# Altium project Hydra A1 UCLO 35131D.PrjPCB (part 14 of 14)
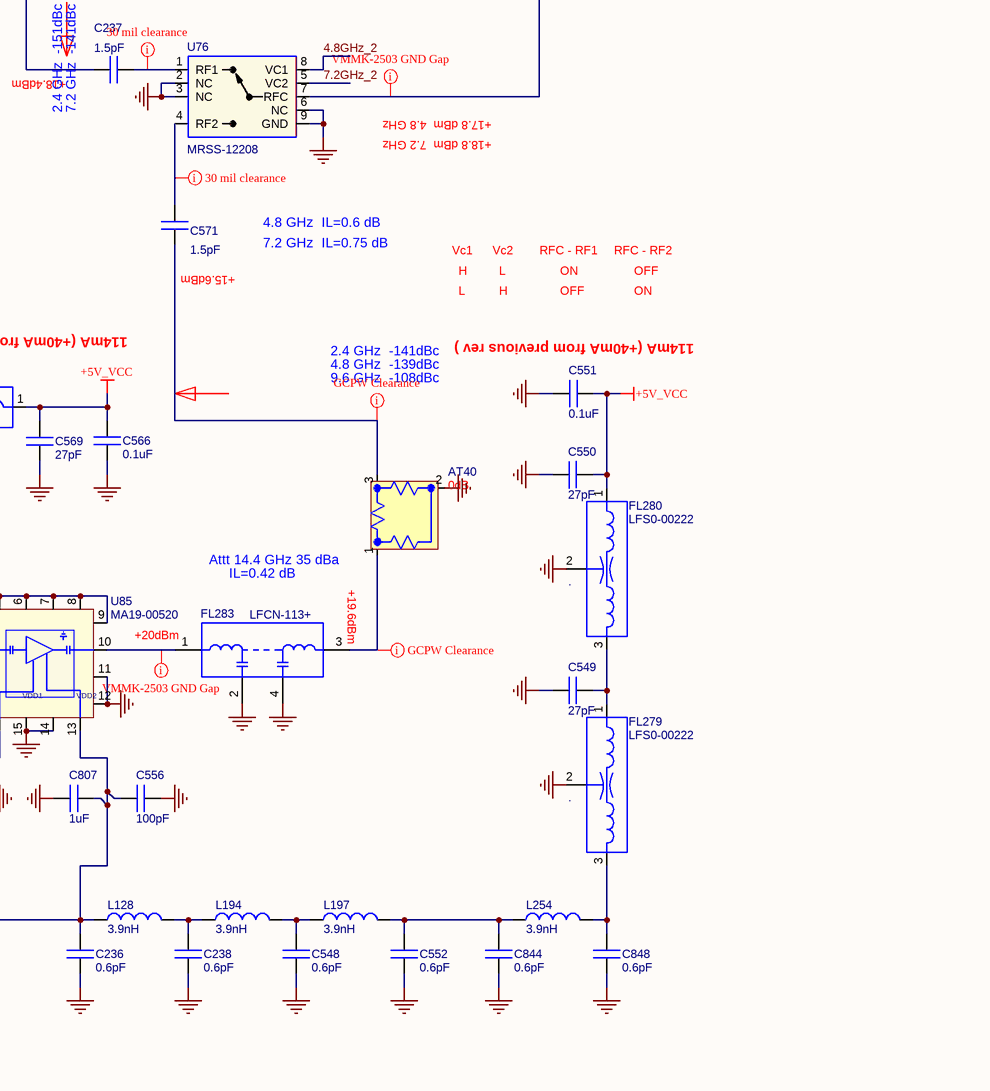
[diagram p77: Modulation.SchDoc, bottom right]

## Sheet Modulation.SchDoc: Modulation (continued)

### Notes on the sheet
- IF STRIP PLUS FREQ MULTIPLIERS
- (near FL67) IL=2 dB
- Attt 4.8 GHz 41 dBa
- Attt 7.2 GHz 28 dBa
- IL=0.3 dB
- (near U92) CL=10 dB
- -13.5 dBm
- CF = 6 GHz
- G = 13.8 dB
- P1 = +17 dBm
- (near L188) 65mA
- CL=9 dB
- CF = 3.6 GHz
- 65mA
- (near FL69) IL=2.5 dB
- (near FL71) IL=2.5 dB
- -18.3dBm (U/C)
- (near U123) P1 = +17 dBm
- (near U123) G = 14 dB
- -4.3 dBm (U/C)
- (near U96) RF2
- (near U96) Vdd
- 1200 MHz Mod from A3
- ??
- (near J16) -4.09 dBm
- -17 dBm (U/C)
- -3.2 dBm (U/C)
- (near FL71) -5.7dBm
- (near U104) -14.7 dBm
- -7.9 dBm
- (near U96) Vctl
- +18.8 dBm  7.2 GHz
- +17.8 dBm  4.8 GHz
- (near FL68) IL=2 dB
- RF1
- (near U96) EN
- -12 dBm
- IL=3.6 dB
- INT 3.6GHz
- P1 = +34 dBm
- (near U96) IL = 1 dB
- (near FL228) EXT 3.6GHz
- +17.7dBm
- Vctl
- L
- H
- EN
- RFC - RF1
- OFF
- ON
- (near FL228) RFC - RF2
- 2.4 GHz  -43dBc
- Attt 2.4 GHz 54 dBa
- Attt 7.2 GHz 27 dBa
- IL=3 dB
- (near FL285) -1.3dBm
- 2.4 GHz  -97dBc
- 7.2 GHz  -71dBc
- G = 14 dB
- P1 = +18 dBm
- +12.7dBm
- IL=6 dB
- 2.4 GHz  -151dBc
- (near FL289) +2 dBm
- 7.2 GHz  -98dBc
- Attt 7.2 GHz 43 dBa
- Attt 9.6 GHz 29 dBa
- IL=0.6 dB
- 1.2 GHz  -143dBc
- 3.6 GHz  -102.5dBc
- 78mA
- (near AT37) 7.2 GHz  -44dBc
- (near U99) +19 dBm
- +17.9dBm
- Attt 1.2 GHz 35 dBa
- Attt 3.6 GHz 18.5 dBa
- IL=1.7 dB
- (near U100) +1.7dBm
- +7.4 dBm
- +5.7 dBm
- (near R255) IL=1.3 dB
- (near AT19) +4.4 dBm
- (near C343) +18 .5dBm
- (near U100) Pin = 10-20 dBm
- 7.2 GHz  -141dBc
- 3.6 GHz  -84dBc
- 1.2 GHz  -108dBc
- +3.4dBm
- (near U100) CL = 15 dB
- (near C237) +18.4dBm
- (near R258) CL=14 dB
- P1 = 17.7 dBm
- G = 21.8 dB
- (near AT27) +16.7dBm
- Attt 3.6 GHz 20 dBa
- IL=0.7 dB
- 75 mA
- -8.3 dBm
- 4.8 GHz  IL=0.6 dB
- 1.2 GHz  -178dBc
- 3.6 GHz  -121dBc
- (near AT27) 1.2 GHz  -178dBc
- (near AT27) 3.6 GHz  -141dBc
- (near FL267) +17.1dBm
- (near U101) P1 = +30 dBm typ
- DC - 8 GHz
- (near FL267) IL=0.8 dB
- +17.8dBm
- (near C571) +15.6dBm
- 7.2 GHz  IL=0.75 dB
- Vc1
- Vc2
- RFC - RF2
- (near U57) +13.5dBm
- +2.8 dBm
- +18 .5dBm
- 114mA (+40mA from previous rev )
- 2.4 GHz  -141dBc
- 4.8 GHz  -139dBc
- (near C551) 114mA (+40mA from previous rev )
- 9.6 GHz  -108dBc
- +11.8dBm
- DCR=2.5 ohm
- 2.4 GHz  -10.32dBc
- 4.8 GHz  -46dBc
- 2.4 GHz  -69dBc
- G = 13.5 dB
- Attt 2.4 GHz 72 dBa
- Attt 4.8 GHz 45 dBa
- (near U85) P1 = +17 dBm
- (near AT40) Attt 14.4 GHz 35 dBa
- 9.6 GHz  -65dBc
- +2.2dBm
- (near FL277) -2dBm
- 4.8 GHz  -94dBc
- Attt 9.6 GHz 43 dBa
- CF = 7.2 GHz
- (near FL72) IL=2 dB
- (near U85) +0.5dBm
- +20dBm
- IL=0.42 dB
- (near FL283) +19.6dBm
- (near FL268) +17.1dBm
- (near U105) +16dBm
- (near U122) +11.5dBm
- (near AT33) +9.5dBm
- 3.6 GHz  -141dBc
- CL = 13.8 dB
- Pin = 13-17 dBm
- IL=1.1 dB
- (near AT29) IL=4.2 dB
- (near AT33) 4.8 GHz  -139dBc
- Attt 2.4 GHz 59 dBa
- Attt 4.8 GHz 48 dBa
- HFCN-6010+_Cascaded.wsx
- Title
- Sheet Title
- PRINTED DOCUMENT IS CONSIDERED UNCONTROLLED. VERIFY REVISION IN PLM SYSTEM.
- THIS DOCUMENT CONTAINS PROPRIETARY INFORMATION. DESIGN RIGHTS BELONG TO GIGA-TRONICS AND MAY NOT BE REPRODUCED WITHOUT WRITTEN AUTHORIZATION FOR ANY REASON EXCEPT CALIBRATION, OPERATION AND MAINTENANCE.
- Size
- CAGE CODE
- Filename
- D
- Document Number
- 58900
- Date
- Sheet
- Rev
- of
- (in symbol LFS0-00222) ,
- (in symbol LFS0-00250) ,
- (in symbol MA19-00520) G
- (in symbol MX02-00103) x 2
- (in symbol MX03-00610) x 3

### Library data of the parts
A1_J18 = 35860: SHIELD,HYDRA,A1-J18; MFGR: Any; Approved: MH; level: 1; ModifyDate: 08/28/15; M_PN: Any; G_PN: 35860; Value: 35860; item_number: 35860
AT17 AT30 AT32-AT36 AT38 AT40 AT41 = MPFC-A1000: NoLoad: .; Approved: CL; M_PN: IMS1141-00DB; MFGR: IMS RESISTORS; level: 1; line_number: 50; ModifyDate: 4/16/13; G_PN: MPFC-A1000; item_number: MPFC-A1000
AT18 = MPFC-A1003: NoLoad: .; Approved: CL; M_PN: IMS1141-03DB; MFGR: IMS RESISTORS; level: 1; line_number: 25; G_PN: MPFC-A1003; item_number: MPFC-A1003
AT19 AT27 AT28 AT37 = MPFC-A1001: NoLoad: .; Approved: CL; M_PN: IMS1141-01DB; MFGR: IMS RESISTORS; level: 1; line_number: 15; G_PN: MPFC-A1001; item_number: MPFC-A1001
  AT27 AT28 AT37: ModifyDate: 3/8/13
AT22 AT29 AT39 = MPFC-A1002: NoLoad: .; Approved: CL; M_PN: IMS1141-02DB; MFGR: IMS RESISTORS; level: 1; line_number: 10; ModifyDate: 3/8/13; G_PN: MPFC-A1002; item_number: MPFC-A1002
AT26 = MPFC-A1009: NoLoad: .; Approved: CL; M_PN: IMS1141-09DB; MFGR: IMS RESISTORS; level: 1; line_number: 40; G_PN: MPFC-A1009; item_number: MPFC-A1009
AT73 AT74 = MPFC-B1002: NoLoad: .; Approved: CL; M_PN: IMS-2533-02DB; MFGR: IMS RESISTORS; level: 1; line_number: 1350; ModifyDate: 10/18/16; G_PN: MPFC-B1002; item_number: MPFC-B1002
C63 C237 C239 C324 C472 C475 C476 C546 C547 C562 C565 C567 C570 C571 C799 = CK41-00015: Approved: CL; NoLoad: .; M_PN: 600L1R5AT200; MFGR: ATC; level: 1; line_number: 170; G_PN: CK41-00015; ModifyDate: 02/09/13; item_number: CK41-00015
C166 C235 C349 C350 C423 C432 C487 C489 C490 C492 C494 C495 C497 C519 C535 C536 C538 C971 = CK41-00056: MFGR: ATC; M_PN: 600L5R6BT200; Approved: CL; NoLoad: .; level: 1; line_number: 120; ModifyDate: 3/11/13; G_PN: CK41-00056; item_number: CK41-00056
C236 C238 C548 C552 C844 C848 = CK41-00006: Approved: CL; NoLoad: .; M_PN: 600L0R6AT200; MFGR: ATC; level: 1; line_number: 225; G_PN: CK41-00006; ModifyDate: 02/22/12; item_number: CK41-00006
C252 C480 C481 C557 C561 = CK41-00005: Approved: CL; NoLoad: .; M_PN: 600L0R5AT200; MFGR: ATC; level: 1; line_number: 130; G_PN: CK41-00005; ModifyDate: 02/22/12; item_number: CK41-00005
C257 C261 C422 C445 C488 C493 C511 C518 C549 C550 C554 C555 C559 C560 C568 C569 = CK40-00270: MFGR: ANY; Approved: CL; NoLoad: .; level: 1; line_number: 215; ModifyDate: 02/22/12; M_PN: ANY; G_PN: CK40-00270; item_number: CK40-00270
C342-C348 C496 = CK40-00120: MFGR: ANY; Approved: CL; NoLoad: .; level: 1; line_number: 165; ModifyDate: 10/06/12; M_PN: ANY; G_PN: CK40-00120; item_number: CK40-00120
C424 C486 C491 = CK40-04100: Approved: CL; NoLoad: .; MFGR: VENKEL; M_PN: C0402X7R160-104KNP; level: 1; line_number: 95; ModifyDate: 3/29/13; G_PN: CK40-04100; item_number: CK40-04100
C434 = CK41-00015: Approved: CL; M_PN: 600L1R5AT200; MFGR: ATC; Value: 1.5pF; level: 1; line_number: 170; G_PN: CK41-00015; ModifyDate: 02/09/13; item_number: CK41-00015
C446 C448 C479 C517 C540 C545 C551 C553 C558 C566 = CK40-04100: Approved: CL; NoLoad: .; M_PN: C0402X7R160-104KNP; MFGR: VENKEL; level: 1; line_number: 95; ModifyDate: 3/29/13; G_PN: CK40-04100; item_number: CK40-04100
C447 = CK40-01470: MFGR: Any; Approved: CL; NoLoad: .; level: 1; line_number: 75; ModifyDate: 02/22/12; M_PN: Any; G_PN: CK40-01470; item_number: CK40-01470
C473 C474 C477 C478 = CK41-00056: Approved: CL; NoLoad: .; M_PN: 600L5R6BT200; MFGR: ATC; level: 1; line_number: 120; G_PN: CK41-00056; ModifyDate: 3/11/13; item_number: CK41-00056
C510 C512 = CK41-00008: NoLoad: .; MFGR: ATC; M_PN: 600L0R8AT200; Approved: CL; level: 1; line_number: 230; G_PN: CK41-00008; ModifyDate: 02/22/12; item_number: CK41-00008
C514 = CK41-00010: NoLoad: .; MFGR: ATC; M_PN: 600L1R0AT200; Approved: CL; level: 1; line_number: 220; G_PN: CK41-00010; ModifyDate: 3/7/13; item_number: CK41-00010
C516 C520 C521 C541-C544 = CK41-00024: NoLoad: .; MFGR: ATC; M_PN: 600L2R4AT200; Approved: CL; level: 1; line_number: 60; G_PN: CK41-00024; ModifyDate: 02/09/13; item_number: CK41-00024
C556 C564 C805 C819 = CK40-01100: Approved: CL; NoLoad: .; M_PN: Any; level: 1; line_number: 70; G_PN: CK40-01100; ModifyDate: 3/21/12; MFGR: Any; item_number: CK40-01100
C563 C801 C807 C824 = CK40-15100: Approved: CL; NoLoad: .; M_PN: C0402X5R160-105KNP; MFGR: VENKEL; level: 1; line_number: 227; ModifyDate: 4/23/13; G_PN: CK40-15100; item_number: CK40-15100
FL32 FL282 = MFH0-02100: MFGR: MINI-CIRCUITS; Approved: CL; Value: HFCN-2100D+; NoLoad: .; level: 1; line_number: 425; G_PN: MFH0-02100; ModifyDate: 3/14/13; item_number: MFH0-02100
FL67 FL68 = 3.6 GHz BPF: Approved: CL; level: 1; ModifyDate: 5/30/13
FL69 FL71 = 6 GHz BPF: Approved: CL; level: 1; MFGR: N/A; ModifyDate: 6/2/13; M_PN: N/A; G_PN: N/A
FL72 = 7.2_GHz_BPF: Approved: CL; level: 1; MFGR: N/A; ModifyDate: 6/2/13
FL212 FL213 FL216 FL217 FL223 FL225-FL227 FL232 FL258 FL259 FL265 FL274 FL275 FL279-FL281 FL287 FL288 FL292 FL293 = LFS0-00222: Approved: CL; NoLoad: .; M_PN: NFE31PT222Z1E9BL; MFGR: MURATA; level: 1; line_number: 335; G_PN: LFS0-00222; ModifyDate: 02/22/12; Value: 2200pF; item_number: LFS0-00222
FL220 FL224 = MFB0-02360: MFGR: MINI-CIRCUITS; Approved: NM; Value: BFCN-2360+; NoLoad: .; level: 1; line_number: 365; ModifyDate: 12/04/12; M_PN: BFCN-2360+; G_PN: MFB0-02360; item_number: MFB0-02360
FL228 FL260 FL266 FL276 = LFS0-00250: Approved: NM; NoLoad: .; M_PN: NFL18ST207X1C3; MFGR: MURATA; level: 1; line_number: 415; ModifyDate: 02/22/12; Value: 25pF; G_PN: LFS0-00250; item_number: LFS0-00250
FL231 = MFL0-03000: MFGR: MINI-CIRCUITS; Approved: CL; Value: LFCN-3000D+; NoLoad: .; level: 1; line_number: 370; G_PN: MFL0-03000; ModifyDate: 3/8/13; item_number: MFL0-03000
FL267 FL268 = MFL0-02500: MFGR: MINI-CIRCUITS; Approved: CL; Value: LFCN-2500+; NoLoad: .; level: 1; line_number: 460; G_PN: MFL0-02500; ModifyDate: 3/5/13; item_number: MFL0-02500
FL277 FL278 = MFH0-06010: MFGR: MINI-CIRCUITS; Approved: CL; Value: HFCN-6010+; NoLoad: .; level: 1; line_number: 390; G_PN: MFH0-06010; ModifyDate: 3/12/13; item_number: MFH0-06010
FL283 = MFL0-11000: MFGR: MINI-CIRCUITS; Approved: CL; Value: LFCN-113+; NoLoad: .; level: 1; line_number: 395; G_PN: MFL0-11000; ModifyDate: 3/14/13; item_number: MFL0-11000
FL285 FL289 = MFH0-04400: MFGR: MINI-CIRCUITS; Approved: CL; Value: HFCN-4400D+; NoLoad: .; level: 1; line_number: 400; G_PN: MFH0-04400; ModifyDate: 3/14/13; item_number: MFH0-04400
FL286 FL290 FL291 = MFL0-05850: NoLoad: .; Value: LFCN-5850D+; MFGR: Mini-Circuits; Approved: NM; level: 1; line_number: 405; ModifyDate: 3/15/13; M_PN: LFCN-5850D+; G_PN: MFL0-05850; item_number: MFL0-05850
FL296 FL297 = MFL1-03900: MFGR: MINI-CIRCUITS; Approved: CL; Value: LFCN-3800D+; NoLoad: .; level: 1; line_number: 470; G_PN: MFL1-03900; ModifyDate: 3/21/13; item_number: MFL1-03900
FT14 FT30 = FromToNode: level: 1; Approved: *; G_PN: *; MFGR: *; Value: *
J16 J22 = JRSM-70101: Value: B012-P93-02; MFGR: GILBERT; Approved: CL; NoLoad: .; level: 1; line_number: 480; M_PN: B012-P93-02; ModifyDate: 10/15/14; G_PN: JRSM-70101; item_number: JRSM-70101
J18 = JRSM-60101: SMPM SM MALE,STRAIGHT SMT, R/A COPLANAR, 4 PIN THRU-HOLE; Value: B012-P95-02; MFGR: GILBERT; Approved: CL; NoLoad: .; level: 1; line_number: 483; M_PN: B012-P95-02; ModifyDate: 1/6/14; G_PN: JRSM-60101; item_number: JRSM-60101
J19 = JRSM-40101: Value: 3287-6101; MFGR: SV MICROWAVE; Approved: CL; level: 1; M_PN: 3287-6101; ModifyDate: 4/10/13; G_PN: JRSM-40101; item_number: JRSM-40101
J21 = JRSM-80100: Value: B012-P93-01; MFGR: Corning Gilbert; Approved: CL; NoLoad: .; level: 1; line_number: 486; M_PN: B012-P93-01; ModifyDate: 10/15/14; G_PN: JRSM-80100; item_number: JRSM-80100
L51 = LSA5-03270: M_PN: 0603HP-27NXGLU; MFGR: COILCRAFT; NoLoad: .; Approved: CL; level: 1; line_number: 565; G_PN: LSA5-03270; ModifyDate: 3/11/13; item_number: LSA5-03270
L122 L189 L191 L192 = LSA6-03150: M_PN: 0402HP-15NXGLU; MFGR: COILCRAFT; NoLoad: .; Approved: CL; level: 1; line_number: 515; G_PN: LSA6-03150; ModifyDate: 3/8/13; item_number: LSA6-03150
L123 L125 = LSA5-03270: MFGR: COILCRAFT; NoLoad: .; Approved: CL; M_PN: 0603HP-27NXGLU; level: 1; line_number: 565; ModifyDate: 3/11/13; G_PN: LSA5-03270; item_number: LSA5-03270
L127 L168-L170 L185 L193 L195 L196 L201-L203 = LSA6-02750: M_PN: 0402HP-7N5XGLU; MFGR: COILCRAFT; NoLoad: .; Approved: CL; level: 1; line_number: 530; G_PN: LSA6-02750; ModifyDate: 3/18/13; item_number: LSA6-02750
L128 L184 L194 L197-L200 L254 = LSA6-02390: M_PN: 0402HP-3N9XGLU; MFGR: COILCRAFT; NoLoad: .; Approved: CL; level: 1; line_number: 620; G_PN: LSA6-02390; ModifyDate: 3/13/13; item_number: LSA6-02390
L186 L187 = LSA6-02560: M_PN: 0402HP-5N6XGLU; MFGR: COILCRAFT; NoLoad: .; Approved: CL; level: 1; line_number: 595; G_PN: LSA6-02560; ModifyDate: 3/4/13; item_number: LSA6-02560
L188 = LSA6-02560: INDUCTOR;5.6NH;2%;6.6GHZ SRF;105Q @1.7GHZ;.048 DCR;1.6A;0402; M_PN: 0402HP-5N6XGLU; MFGR: COILCRAFT; NoLoad: .; Approved: CL; level: 1; line_number: 595; G_PN: LSA6-02560; ModifyDate: 3/4/13; item_number: LSA6-02560
L188DC L190DC = TLW0-01220: Inductor, broadband, 0.22uH, 0.138IN long, DCR=0.10 Ohms; M_PN: BCL-221JL; MFGR: Coilcraft; Approved: XiaoXiao Zhou; level: 1; line_number: 532; Value: 0.22uH; G_PN: TLW0-01220; item_number: TLW0-01220
L190 = LSA6-03150: INDUCTOR;15NH;2%;3.9GHZ SRF;85Q @1.7GHZ;.078 DCR;1.1A;0402; M_PN: 0402HP-15NXGLU; MFGR: COILCRAFT; Approved: CL; level: 1; line_number: 515; G_PN: LSA6-03150; ModifyDate: 3/8/13; item_number: LSA6-03150
MTG32 MTG33 MTG36 MTG37 MTG45 MTG75 MTG86 MTG87 MTG89-MTG93 MTG147-MTG172 MTG178-MTG191 MTG200 = MHP200X92: level: 1; ModifyDate: 02/14/2008 14:07:19; Value: *
R17 R20 R22 R23 = RK35-00499: Approved: CL; NoLoad: .; MFGR: ANY; level: 1; line_number: 650; ModifyDate: 02/22/12; G_PN: RK35-00499; M_PN: ANY; item_number: RK35-00499
R252 R259 R389 = RK65-00392: NoLoad: .; MFGR: VISHAY/DALE; Approved: CL; M_PN: CRCW201039R2FKEF; level: 1; line_number: 892; ModifyDate: 10/14/14; G_PN: RK65-00392; item_number: RK65-00392
R255 = RK35-01210: Approved: CL; NoLoad: .; M_PN: ANY; level: 1; line_number: 770; ModifyDate: 02/22/12; MFGR: ANY; G_PN: RK35-01210; item_number: RK35-01210
R258 = RK35-01210: NoLoad: .; MFGR: ANY; Approved: CL; level: 1; line_number: 770; ModifyDate: 02/22/12; G_PN: RK35-01210; M_PN: ANY; item_number: RK35-01210
R391 R392 R398 R458-R460 = RK35-11000: NoLoad: .; Approved: CL; MFGR: ANY; level: 1; line_number: 1025; G_PN: RK35-11000; ModifyDate: 02/22/12; M_PN: ANY; item_number: RK35-11000
R396 R397 R496 R497 = RK35-03010: NoLoad: .; Approved: CL; MFGR: ANY; level: 1; line_number: 835; G_PN: RK35-03010; ModifyDate: 4/12/12; M_PN: ANY; item_number: RK35-03010
U57 U95 U103 = MA20-00006: M_PN: SKY65017-70LF; Approved: CL; MFGR: SKYWORKS; NoLoad: .; Value: SKY65017-70LF; level: 1; line_number: 1160; G_PN: MA20-00006; ModifyDate: 6/26/14; item_number: MA20-00006
U76 = MRSS-12208: M_PN: MASW-007107; NoLoad: .; Approved: NM; MFGR: MA-COM; level: 1; line_number: 1305; ModifyDate: 12/06/12; G_PN: MRSS-12208; item_number: MRSS-12208
U85 = MA19-00520: Value: HMC451LC3; NoLoad: .; Approved: CL; MFGR: HITTITE; level: 1; line_number: 1323; ModifyDate: 1/25/13; G_PN: MA19-00520; M_PN: HMC451LC3; item_number: MA19-00520
U90 U90DC U123 U123DC = MA14-00112: AMP;1-12GHz;13.5dB;+17dBm;5V;68mA;WLP-0402; Approved: NM; MFGR: AVAGO; level: 1; line_number: 1340; ModifyDate: 11/28/12; G_PN: MA14-00112; item_number: MA14-00112
  U90DC U123 U123DC: M_PN: VMMK-2503
U92 = MMDC-00310: MIXER;3-10GHZ;+17DBM;0-4GHZ IF;.118INX.118INX.036IN SMT; MFGR: HITTITE; NoLoad: .; Value: HMC787LC3B; level: 1; line_number: 1345; ModifyDate: 1/15/14; M_PN: HMC787LC3B; G_PN: MMDC-00310; item_number: MMDC-00310
U96 = MRSS-12206: MFGR: HITTITE; Approved: CL; Value: HMC849ALP4CE; NoLoad: .; level: 1; line_number: 1347; ModifyDate: 8/5/14; G_PN: MRSS-12206; item_number: MRSS-12206
U98 U122 = MA14-00112: NoLoad: .; Approved: NM; MFGR: AVAGO; level: 1; line_number: 1340; ModifyDate: 11/28/12; G_PN: MA14-00112; item_number: MA14-00112
U99 = MA19-00520: NoLoad: .; Approved: CL; MFGR: HITTITE; Value: HMC451LC3; level: 1; line_number: 1323; ModifyDate: 1/25/13; M_PN: HMC451LC3; G_PN: MA19-00520; item_number: MA19-00520
U100 = MX02-00103: M_PN: HMC188MS8E; NoLoad: .; Approved: CL; MFGR: HITTITE; Value: HMC188MS8E; level: 1; line_number: 1100; ModifyDate: 3/11/13; G_PN: MX02-00103; item_number: MX02-00103
U101 = MRSS-12004: Value: HMC284MS8GE; MFGR: HITTITE; NoLoad: .; Approved: CL; level: 1; line_number: 1105; ModifyDate: 6/1/13; M_PN: HMC284MS8GE; G_PN: MRSS-12004; item_number: MRSS-12004
U104 = MMDD-00612: MIXER;6-12GHZ;+17DBM;0-4GHZ IF;.118INX.118INX.036IN SMT; MFGR: HITTITE; NoLoad: .; Value: HMC663LC3; level: 1; line_number: 1107; ModifyDate: 9/17/13; M_PN: HMC663LC3; G_PN: MMDD-00612; item_number: MMDD-00612
U105 = MX03-00610: NoLoad: .; Approved: CL; MFGR: MINI-CIRCUITS; Value: RMK-3-14+; level: 1; line_number: 1110; ModifyDate: 3/12/13; G_PN: MX03-00610; item_number: MX03-00610
U110 = UTD3-00049: M_PN: NL27WZ04DFT2G; Value: NL27WZ04DFT2G; NoLoad: .; Approved: CL; MFGR: ON SEMI; level: 1; line_number: 1250; ModifyDate: 02/22/12; G_PN: UTD3-00049; item_number: UTD3-00049

## Nets that join several sheets
+2.5V_Dig: Power Distribution Block Diagram (J30.1), A3 to A1 board Connector b (16 pins)
+3.3V_dig: Power Distribution Block Diagram (J29.5), A3 to A1 board Connector b (15 pins)
+3.3V_mux: Analog Mux (FL5.3), Power Distribution Block Diagram (J29.6)
+3.3V_ST: Power Distribution Block Diagram (C509.2 J29.8), STALO_2 (C891.1 C892.2 FL22.3)
+3.3V_vco: Fast PLL (15 pins), Power Distribution Block Diagram (C508.2 J29.9)
+3V_A1-A1: A1-A1 Active Bias (FL109.1 FL116.1 FT25.1 TP5.1), Power Distribution Block Diagram (J30.2)
+5V_A1-A1: A1-A1 Active Bias (10 pins), Power Distribution Block Diagram (J30.6)
+5V_A1-A2: Power Distribution Block Diagram (J30.9), A1-A2 Power (FL165.1 TP11.1)
+5V_A1-A3: Analog Mux (5 pins), Power Distribution Block Diagram (J30.8)
+5V_alc: A1-A2 Switches new (8 pins), A1-A1 Gain control driver (9 pins), Power Distribution Block Diagram (J31.4)
+5V_dig: Power Distribution Block Diagram (J31.3), A3 to A1 board Connector b (23 pins)
+5V_mux: Analog Mux (10 pins), Power Distribution Block Diagram (J31.5)
+5V_ST: Power Distribution Block Diagram (J33.1), STALO_2 (7 pins), STALO_1 (7 pins), STALO_3 (6 pins)
+5V_SW: A1-A2 Switches new (39 pins), A1-A1 Switches Control Logic (19 pins), A1-A1 Switches new (113 pins), Power Distribution Block Diagram (J30.4), A3 to A1 board Connector b (C398.2 C852.1 U84.6)
+5V_VCC: Fast PLL Page 2 (C372.2 FL13.1), Fast PLL (14 pins), Power Distribution Block Diagram (C500.2 J31.8 J31.9), 9.6 GHz LO Driver (9 pins), Modulation (22 pins)
+6V_FETs: A1-A1 Active Bias (31 pins), Power Distribution Block Diagram (J32.1 J32.2), Modulation (C445.1 C448.2 FL223.3)
+6V_vco: Fast PLL (C1238.2 Q3.3), Power Distribution Block Diagram (J32.3)
+7.5V: 1.2GHz Comb Gen Driver (C24.1 C51.1 FL44.1), Power Distribution Block Diagram (C505.2 J32.5)
+8V_A: Power Distribution Block Diagram (C499.2 J32.6), Modulation (10 pins)
+8V_A1-A2: Power Distribution Block Diagram (J31.6), A1-A2 Power (FL162.1 TP10.1)
+8V_B: Power Distribution Block Diagram (C501.2 J32.7), Ref Mult (11 pins)
+8V_ST: Power Distribution Block Diagram (C507.2 J32.9), STALO_2 (7 pins), STALO_1 (11 pins)
+8V_vco: Fast PLL (10 pins), Power Distribution Block Diagram (C506.2 J32.8)
+12V_A1-A2: Analog Mux (FL196.3), Power Distribution Block Diagram (J33.8 J33.9), A1-A2 Power (FL156.1 TP9.1)
+12V_b: Power Distribution Block Diagram (J33.3), STALO_2 (C1224.1 C1226.1 R781.1)
+12V_SRD: 200MHz_Comb_Gen_Driver (C208.1 C573.1 FL294.3), Power Distribution Block Diagram (C504.2 J33.5)
+12V_VCO: Fast PLL (7 pins), Power Distribution Block Diagram (C503.2 J33.4)
+15V_VCO: Fast PLL (7 pins), Power Distribution Block Diagram (C502.2 J33.6)
-3.3_vco: Fast PLL Page 2 (5 pins), Fast PLL (C279.1 C281.1 C289.1 FL198.1), Power Distribution Block Diagram (C513.2 J31.1)
-5V_A1-A3: Analog Mux (5 pins), Power Distribution Block Diagram (J28.1)
-5V_mux: Analog Mux (FL172.3), Power Distribution Block Diagram (J28.2)
-5V_ST: Power Distribution Block Diagram (J28.3), STALO_2 (7 pins), STALO_1 (7 pins), STALO_3 (FL18.3 FL38.3)
-5V_SW: A1-A1 Switches new (37 pins), Power Distribution Block Diagram (J28.5)
-5V_VCO: Fast PLL (C68.2 C75.2 L21.2), Power Distribution Block Diagram (J28.6)
-7V_VCO: Fast PLL (C328.1 C331.1 FL242.3), Power Distribution Block Diagram (J28.8)
-10V: Power Distribution Block Diagram (J29.3), A3 to A1 board Connector b (5 pins)
-10V_alc: A1-A2 Switches new (7 pins), A1-A1 Gain control driver (7 pins), Power Distribution Block Diagram (J28.9)
-12V_SW: A1-A2 Switches new (24 pins), A1-A1 Switches new (49 pins), Power Distribution Block Diagram (J29.1)
GND: Sheet1_35131-35133 (99 pins), A1-A2 Switches new (34 pins), 1.2GHz Comb Gen Driver (38 pins), A1-A1 Active Bias (153 pins), A1-A1 Gain control driver (18 pins), Fast PLL Page 2 (46 pins), Fast PLL (337 pins), A1-A1 Switches Control Logic (20 pins), Analog Mux (62 pins), A1-A1 Switches new (114 pins), 200MHz_Comb_Gen_Driver (41 pins), Power Distribution Block Diagram (36 pins), A1-A2 Power (12 pins), Ref Mult (88 pins), A3 to A1 board Connector b (185 pins), STALO_2 (581 pins), STALO_1 (590 pins), STALO_3 (48 pins), 9.6 GHz LO Driver (79 pins), Modulation (328 pins)
~{100ps}: A1-A1 Switches Control Logic (R588.2), A1-A1 Switches new (SW14.1 SW14.16)
2-8.3: A1-A1 Switches Control Logic (R579.2), A1-A1 Switches new (SW3.1 SW3.16)
~{200ps}: A1-A1 Switches Control Logic (R589.2), A1-A1 Switches new (SW9.1 SW9.16)
~{400ps_1}: A1-A1 Switches Control Logic (R590.2), A1-A1 Switches new (SW13.1 SW13.16)
~{400ps_2}: A1-A1 Switches Control Logic (R591.2), A1-A1 Switches new (SW12.1 SW12.16)
8.3-10.2: A1-A1 Switches Control Logic (R372.2), A1-A1 Switches new (SW3.8 SW3.9)
8.3_GHz_LPF: A1-A1 Switches Control Logic (R371.2), A1-A1 Switches new (SW24.1 SW24.16)
10.2-11.4: A1-A1 Switches Control Logic (R373.2), A1-A1 Switches new (SW4.1 SW4.16)
11.4-13.6: A1-A1 Switches Control Logic (R374.2), A1-A1 Switches new (SW4.8 SW4.9)
13.6-15.4: A1-A1 Switches Control Logic (R375.2), A1-A1 Switches new (SW5.1 SW5.16)
15.4-18.6: A1-A1 Switches Control Logic (R402.2), A1-A1 Switches new (SW5.8 SW5.9)
20_GHz_LPF: A1-A1 Switches Control Logic (R580.2), A1-A1 Switches new (SW24.8 SW24.9)
22.5_GHz_IF: A1-A1 Switches Control Logic (R592.2), A1-A1 Switches new (SW11.8 SW11.9)
29.2_GHz_IF: A1-A1 Switches Control Logic (R593.2), A1-A1 Switches new (SW11.1 SW11.16)
400ps_2: A1-A1 Switches Control Logic (U59.13), A1-A1 Switches new (SW12.8 SW12.9), A3 to A1 board Connector b (R510.2)
2400MHz_Mod: Ref Mult (C498.2), Modulation (FL220.1)
9600_MHz: 9.6 GHz LO Driver (FL59.3), Modulation (U104.2)
A1-A2_FILTER_A: A1-A2 Switches new (U43.2 U43.14), A3 to A1 board Connector b (R572.2)
A1-A2_FILTER_B: A1-A2 Switches new (U43.3 U43.13), A3 to A1 board Connector b (R573.2)
A1-A2_FILTER_C: A1-A2 Switches new (6 pins), A3 to A1 board Connector b (R574.2)
A1_I2C_CLK_BUF: Analog Mux (R277.1 U65.4), A3 to A1 board Connector b (J7.49)
A1_I2C_DATA_BUF: Analog Mux (R278.1 U65.5), A3 to A1 board Connector b (J7.47)
A1_PLL_DAC_CLK: Fast PLL (FL160.1 U41.1 U41.2), A3 to A1 board Connector b (R536.2)
ALC_ADC_IN_N: Analog Mux (R93.2), A3 to A1 board Connector b (J7.23)
ALC_ADC_IN_P: Analog Mux (SW2.3 SW2.14), A3 to A1 board Connector b (J7.21)
ALC_VAR_ATTN_HIBAND_IOUT_N: A1-A2 Switches new (R82.1), A3 to A1 board Connector b (J7.11)
ALC_VAR_ATTN_HIBAND_IOUT_P: A1-A2 Switches new (R75.1), A3 to A1 board Connector b (J7.9)
ALC_VAR_ATTN_LOBAND_IOUT_N: Analog Mux (R359.2), A3 to A1 board Connector b (J7.17)
ALC_VAR_ATTN_LOBAND_IOUT_P: Analog Mux (R361.2), A3 to A1 board Connector b (J7.15)
~{BANK_1_NEG}: STALO_2 (C233.1 C357.1 R102.1 R113.1), STALO_3 (R376.2)
~{BANK_2_NEG}: STALO_2 (C840.1 C842.1 R293.1 R295.1), STALO_3 (R377.2)
~{BANK_3_NEG}: STALO_2 (C180.1 C182.1 R83.1 R88.1), STALO_3 (R378.2)
~{BANK_4_NEG}: STALO_2 (C861.1 C863.1 R302.1 R304.1), STALO_3 (R379.2)
~{BANK_5_NEG}: STALO_2 (C106.1 C108.1 R10.1 R65.1), STALO_3 (R445.2)
~{BANK_6_NEG}: STALO_2 (C876.1 C878.1 R308.1 R310.1), STALO_3 (R446.2)
BANK_1_NEG: STALO_2 (C356.1 C399.1 R112.1 R114.1), STALO_3 (R653.2)
BANK_1_POS: STALO_2 (C184.1 C855.1 L69.1 L235.1), STALO_3 (R610.2)
BANK_2_NEG: STALO_2 (C841.1 C843.1 R294.1 R296.1), STALO_3 (R654.2)
BANK_2_POS: STALO_2 (C175.1 C826.1 L68.1 L152.1), STALO_3 (R611.2)
BANK_3_NEG: STALO_2 (C181.1 C183.1 R87.1 R91.1), STALO_3 (R655.2)
BANK_3_POS: STALO_2 (C185.1 L71.1 R57.1), STALO_3 (R612.2)
BANK_4_NEG: STALO_2 (C862.1 C864.1 R303.1 R305.1), STALO_3 (R656.2)
BANK_4_POS: STALO_2 (C118.1 L67.1 R54.1), STALO_3 (R613.2)
BANK_5_NEG: STALO_2 (C107.1 C109.1 R64.1 R66.1), STALO_3 (R657.2)
BANK_5_POS: STALO_2 (C186.1 L73.1 R58.1), STALO_3 (R614.2)
BANK_6_NEG: STALO_2 (C877.1 C879.1 R309.1 R311.1), STALO_3 (R658.2)
BANK_6_POS: STALO_2 (C117.1 L66.1 R53.1), STALO_3 (R615.2)
LOWER_LO: A1-A1 Switches Control Logic (R594.2), A1-A1 Switches new (SW10.1 SW10.16 SW22.1 SW22.16)
MUX_0_N: Analog Mux (R94.2 U58.1), A3 to A1 board Connector b (J7.31)
MUX_0_P: Analog Mux (R94.1 U58.2), A3 to A1 board Connector b (J7.29)
NetA1_T47: A1-A1 Gain control driver (R223.2 R225.2 T47.1), A1-A1 Switches new (A1.T47)
NetA1_T48: A1-A1 Gain control driver (R227.2 R228.2 T48.1), A1-A1 Switches new (A1.T48)
NetA1_T51: A1-A2 Switches new (SW23.2 SW23.15 T51.1 TP61.1), A1-A1 Switches new (A1.T51)
NetA1_T52: A1-A2 Switches new (SW21.2 SW21.15 T52.1 TP60.1), A1-A1 Switches new (A1.T52)
NetA1_T100: A1-A2 Switches new (A1.T100), A1-A2 Power (C28.1 FL166.3 T100.1)
NetA1_T101: A1-A2 Switches new (A1.T101 A1.T102), A1-A2 Power (C110.2 FL163.3 T101.1 T102.1)
NetA1_T103: A1-A2 Switches new (A1.T103), A1-A2 Power (C1033.2 FL157.3 T103.1)
NetAT58_3: 200MHz_Comb_Gen_Driver (AT58.3), STALO_1 (L2.1)
NetAT65_1: STALO_2 (FL48.3), STALO_3 (AT65.1)
NetC449_1: Fast PLL Page 2 (C449.1 R407.1), A3 to A1 board Connector b (R530.2)
NetC450_1: Fast PLL Page 2 (C450.1 R463.1), A3 to A1 board Connector b (R532.2)
NetC451_1: Fast PLL Page 2 (C451.1 R464.1), A3 to A1 board Connector b (R534.2)
NetC452_1: Fast PLL Page 2 (C452.1 R467.1), A3 to A1 board Connector b (R533.2)
NetC453_1: Fast PLL Page 2 (C453.1 R465.1), A3 to A1 board Connector b (R531.2)
NetC454_1: Fast PLL Page 2 (C454.1 R468.1), A3 to A1 board Connector b (R535.2)
NetC522_2: 1.2GHz Comb Gen Driver (C522.2 R12.1), Ref Mult (U69.4)
NetC979_2: A3 to A1 board Connector b (R502.1), STALO_3 (C979.2 L253.2)
NetFL167_1: Fast PLL (FL167.1), A3 to A1 board Connector b (R512.2)
NetFL182_1: Fast PLL (FL182.1), A3 to A1 board Connector b (R511.2)
NetFL191_1: Fast PLL (FL191.1), A3 to A1 board Connector b (R520.2)
NetFL192_1: Fast PLL (FL192.1), A3 to A1 board Connector b (R519.2)
NetFL197_1: Fast PLL (FL197.1), A3 to A1 board Connector b (R529.2)
NetFL202_1: Fast PLL Page 2 (U117.5), Fast PLL (FL202.1)
NetFL203_1: Fast PLL Page 2 (U117.3), Fast PLL (FL203.1)
NetFL204_1: Fast PLL Page 2 (U116.11), Fast PLL (FL204.1)
NetFL205_1: Fast PLL Page 2 (U116.13), Fast PLL (FL205.1)
NetFL206_1: Fast PLL Page 2 (U116.5), Fast PLL (FL206.1)
NetFL207_1: Fast PLL Page 2 (U116.3), Fast PLL (FL207.1)
NetFL208_1: Fast PLL (FL208.1), A3 to A1 board Connector b (R517.2)
NetFL209_1: Fast PLL (FL209.1), A3 to A1 board Connector b (R518.2)
NetFL228_3: A3 to A1 board Connector b (R566.2), Modulation (FL228.3)
NetFL246_1: Fast PLL (FL246.1), Ref Mult (U72.1)
NetFL295_1: Fast PLL (FL295.1), A3 to A1 board Connector b (R521.2)
NetJ6_3: Analog Mux (J6.3), A3 to A1 board Connector b (R553.2)
NetJ6_5: Analog Mux (J6.5), A3 to A1 board Connector b (R552.2)
NetJ6_7: Analog Mux (J6.7), A3 to A1 board Connector b (R417.2)
NetJ6_9: Analog Mux (J6.9), A3 to A1 board Connector b (R101.2)
NetJ6_13: Analog Mux (J6.13 R556.1), A3 to A1 board Connector b (R528.2)
NetR507_2: A1-A1 Switches Control Logic (U59.1), A1-A1 Switches new (SW14.8 SW14.9), A3 to A1 board Connector b (R507.2)
NetR508_2: A1-A1 Switches Control Logic (U59.3), A1-A1 Switches new (SW9.8 SW9.9), A3 to A1 board Connector b (R508.2)
NetR509_2: A1-A1 Switches Control Logic (U59.5), A1-A1 Switches new (SW13.8 SW13.9), A3 to A1 board Connector b (R509.2)
NetR527_2: A3 to A1 board Connector b (R527.2), Modulation (U110.1)
NetR545_2: A3 to A1 board Connector b (R545.2), STALO_3 (U26.3)
NetR546_2: A3 to A1 board Connector b (R546.2), STALO_3 (U26.2)
NetR547_2: A3 to A1 board Connector b (R547.2), STALO_3 (U26.1)
NetR565_2: A1-A1 Switches Control Logic (U59.11), A3 to A1 board Connector b (R565.2)
NetR567_2: A1-A1 Switches Control Logic (U54.1), A3 to A1 board Connector b (R567.2)
NetR568_2: A1-A1 Switches Control Logic (U54.2), A3 to A1 board Connector b (R568.2)
NetR569_2: A1-A1 Switches Control Logic (U54.3), A3 to A1 board Connector b (R569.2)
NetR571_2: A1-A1 Switches Control Logic (U63.1), A3 to A1 board Connector b (R571.2)
NetR575_2: A1-A1 Switches Control Logic (U45.1), A3 to A1 board Connector b (R575.2)
NetR576_2: A1-A1 Switches Control Logic (U45.2), A3 to A1 board Connector b (R576.2)
NetR577_2: A1-A1 Switches Control Logic (U45.3), A3 to A1 board Connector b (R577.2)
NetU1_6: Ref Mult (U168.4), STALO_1 (U1.6)
PREDIST_ATTN_IOUT_N: A1-A1 Gain control driver (R62.2 R211.1), A3 to A1 board Connector b (J7.5)
PREDIST_ATTN_IOUT_P: A1-A1 Gain control driver (R60.1 R61.2 R210.1), A3 to A1 board Connector b (J7.3)
~{SRD_BANK_1_NEG}: STALO_1 (C764.1 C797.1 R622.1 R624.1), STALO_3 (R8.2)
~{SRD_BANK_2_NEG}: STALO_1 (C898.1 C900.1 R626.1 R628.1), STALO_3 (R9.2)
~{SRD_BANK_3_NEG}: STALO_1 (C760.1 C762.1 R618.1 R620.1), STALO_3 (R312.2)
~{SRD_BANK_4_NEG}: STALO_1 (C906.1 C908.1 R630.1 R632.1), STALO_3 (R313.2)
~{SRD_BANK_5_NEG}: STALO_1 (C754.1 C896.1 R319.1 R616.1), STALO_3 (R314.2)
~{SRD_BANK_6_NEG}: STALO_1 (C914.1 C916.1 R634.1 R636.1), STALO_3 (R369.2)
SRD_7.2: A1-A1 Switches Control Logic (R403.2), A1-A1 Switches new (SW6.1 SW6.16)
SRD_8.4-9.6: A1-A1 Switches Control Logic (R583.2), A1-A1 Switches new (SW6.8 SW6.9)
SRD_10.8-12: A1-A1 Switches Control Logic (R584.2), A1-A1 Switches new (SW7.1 SW7.16)
SRD_13.2-14.4: A1-A1 Switches Control Logic (R585.2), A1-A1 Switches new (SW7.8 SW7.9)
SRD_15.6-16.8: A1-A1 Switches Control Logic (R586.2), A1-A1 Switches new (SW8.1 SW8.16)
SRD_18-19.2: A1-A1 Switches Control Logic (R587.2), A1-A1 Switches new (SW8.8 SW8.9)
SRD_BANK_1_NEG: STALO_1 (C792.1 C798.1 R623.1 R625.1), STALO_3 (R45.2)
SRD_BANK_1_POS: STALO_1 (C938.1 C940.1 L222.1 L223.1), STALO_3 (R33.2)
SRD_BANK_2_NEG: STALO_1 (C899.1 C901.1 R627.1 R629.1), STALO_3 (R46.2)
SRD_BANK_2_POS: STALO_1 (C918.1 C928.1 L217.1 L219.1), STALO_3 (R34.2)
SRD_BANK_3_NEG: STALO_1 (C761.1 C763.1 R619.1 R621.1), STALO_3 (R49.2)
SRD_BANK_3_POS: STALO_1 (C941.1 L224.1 R183.2), STALO_3 (R37.2)
SRD_BANK_4_NEG: STALO_1 (C907.1 C909.1 R631.1 R633.1), STALO_3 (R50.2)
SRD_BANK_4_POS: STALO_1 (C926.1 L216.1 R178.2), STALO_3 (R40.2)
SRD_BANK_5_NEG: STALO_1 (C895.1 C897.1 R322.1 R617.1), STALO_3 (R51.2)
SRD_BANK_5_POS: STALO_1 (C942.1 L225.1 R182.2), STALO_3 (R42.2)
SRD_BANK_6_NEG: STALO_1 (C915.1 C917.1 R635.1 R637.1), STALO_3 (R52.2)
SRD_BANK_6_POS: STALO_1 (C924.1 L215.1 R180.2), STALO_3 (R44.2)
STALO_LO: STALO_2 (AT62.1), STALO_1 (AT56.1)
T1: A1-A1 Active Bias (C65.1 FL96.3 T1.1), A1-A1 Switches new (A1.T1)
T14: A1-A1 Active Bias (C1004.2 NT3.2 T14.1), A1-A1 Switches new (A1.T14)
T15: A1-A1 Active Bias (C1016.2 T15.1 U77.22), A1-A1 Switches new (A1.T15)
T16: A1-A1 Active Bias (C984.2 NT1.2 T16.1), A1-A1 Switches new (A1.T16)
T17: A1-A1 Active Bias (C988.2 T17.1 U38.22), A1-A1 Switches new (A1.T17)
T34: A1-A1 Active Bias (5 pins), A1-A1 Switches new (A1.T34)
T35: A1-A1 Active Bias (C1049.2 T35.1 TP3.1 U38.23), A1-A1 Switches new (A1.T35)
T36: A1-A1 Active Bias (C87.2 L263.2 T36.1), A1-A1 Switches new (A1.T36)
T37: A1-A1 Active Bias (C74.2 T37.1 TP50.1 U30.21), A1-A1 Switches new (A1.T37)
T38: A1-A1 Active Bias (C70.1 FL101.3 T38.1), A1-A1 Switches new (A1.T38)
T39: A1-A1 Active Bias (C1060.2 L262.2 T39.1), A1-A1 Switches new (A1.T39)
T40: A1-A1 Active Bias (C81.1 T40.1 TP8.1 U64.21), A1-A1 Switches new (A1.T40)
T43: A1-A1 Active Bias (C84.1 FL115.3 T43.1), A1-A1 Switches new (A1.T43)
T44: A1-A1 Active Bias (C77.1 FL108.3 T44.1), A1-A1 Switches new (A1.T44)
T49: A1-A1 Active Bias (5 pins), A1-A1 Switches new (A1.T49)
T50: A1-A1 Active Bias (5 pins), A1-A1 Switches new (A1.T50)
T53: A1-A1 Active Bias (5 pins), A1-A1 Switches new (A1.T53)
T54: A1-A1 Active Bias (L260.2 T54.1), A1-A1 Switches new (A1.T54)
T55: A1-A1 Active Bias (L264.2 T55.1), A1-A1 Switches new (A1.T55)
T70: A1-A1 Active Bias (C1018.2 T70.1 TP12.1 U77.23), A1-A1 Switches new (A1.T70)
T71: A1-A1 Active Bias (C1010.1 NT3.1 T71.1 TP16.1), A1-A1 Switches new (A1.T71)
T72: A1-A1 Active Bias (C79.1 FL110.3 T72.1), A1-A1 Switches new (A1.T72)
T77: A1-A1 Active Bias (T77.1), A1-A1 Switches new (A1.T77)
T78: A1-A1 Active Bias (T78.1), A1-A1 Switches new (A1.T78)
T79: A1-A1 Active Bias (C72.1 FL103.3 T79.1), A1-A1 Switches new (A1.T79)
T84: A1-A1 Active Bias (C960.1 L259.2 R186.2 T84.1), A1-A1 Switches new (A1.T84)
T89: A1-A2 Switches new (A1.T89), A3 to A1 board Connector b (R380.2 T89.1)
UPPER_LO: A1-A1 Switches Control Logic (R595.2), A1-A1 Switches new (SW10.8 SW10.9 SW22.8 SW22.9)
VCO_OUT: Fast PLL Page 2 (U115.2), Fast PLL (AT20.1)

## Assembly variants
35132: not fitted 0 2 A1 A1_J1 A1_J18 C434 C578 C581 C605 C616 C789 C821 C959 COAX1 COAX2 COAX3 COAX4 COAX5 COAX6 COAX8 COAX9 COAX10 COAX11 COAX12 COAX13 COAX14 COAX15 COAX16 COAX17 COAX18 COAX19 COAX20 COAX21 FL21 FL69 FL71 FL72 FT1 FT2 FT3 FT4 FT5 FT6 FT7 FT8 FT9 FT10 FT11 FT13 FT14 FT15 FT16 FT17 FT18 FT19 FT20 FT21 FT22 FT23 FT24 FT25 FT26 FT27 FT28 FT29 FT30 FT31 FT32 FT33 FT34 FT35 FUD1 FUD2 FUD3 FUD4 FUD5 FUD6 J19 J23 J24 J25 L8 L9 L10 L11 L17 L18 L54 L55 L78 L79 L84 L85 L153 L154 L155 L157 L188DC L190DC L231 L232 L233 L234 L240 L241 L242 L243 MH1 MH2 MH3 MH4 MH5 MH6 MH7 MH8 MH9 MH10 MH11 MH12 MH13 MH14 MH15 MH16 MH17 MH18 MH19 MTG1 MTG2 MTG3 MTG4 MTG5 MTG6 MTG7 MTG8 MTG9 MTG10 MTG11 MTG12 MTG13 MTG14 MTG15 MTG16 MTG17 MTG18 MTG19 MTG20 MTG21 MTG22 MTG23 MTG24 MTG25 MTG26 MTG27 MTG28 MTG29 MTG30 MTG31 MTG32 MTG33 MTG34 MTG35 MTG36 MTG37 MTG38 MTG39 MTG40 MTG41 MTG42 MTG43 MTG44 MTG45 MTG46 MTG47 MTG48 MTG49 MTG50 MTG51 MTG52 MTG53 MTG54 MTG55 MTG56 MTG57 MTG58 MTG59 MTG60 MTG61 MTG62 MTG63 MTG64 MTG65 MTG66 MTG67 MTG68 MTG69 MTG70 MTG71 MTG72 MTG73 MTG74 MTG75 MTG76 MTG77 MTG78 MTG79 MTG80 MTG81 MTG82 MTG83 MTG84 MTG85 MTG86 MTG87 MTG88 MTG89 MTG90 MTG91 MTG92 MTG93 MTG94 MTG95 MTG96 MTG97 MTG98 MTG99 MTG100 MTG101 MTG102 MTG103 MTG104 MTG105 MTG106 MTG107 MTG108 MTG109 MTG110 MTG111 MTG112 MTG113 MTG114 MTG115 MTG116 MTG117 MTG118 MTG119 MTG120 MTG121 MTG122 MTG123 MTG124 MTG125 MTG126 MTG127 MTG128 MTG129 MTG130 MTG131 MTG132 MTG133 MTG134 MTG135 MTG136 MTG137 MTG138 MTG139 MTG140 MTG141 MTG142 MTG143 MTG144 MTG145 MTG146 MTG147 MTG148 MTG149 MTG150 MTG151 MTG152 MTG153 MTG154 MTG155 MTG156 MTG157 MTG158 MTG159 MTG160 MTG161 MTG162 MTG163 MTG164 MTG165 MTG166 MTG167 MTG168 MTG169 MTG170 MTG171 MTG172 MTG173 MTG174 MTG175 MTG176 MTG177 MTG178 MTG179 MTG180 MTG181 MTG182 MTG183 MTG184 MTG185 MTG186 MTG187 MTG188 MTG189 MTG190 MTG191 MTG192 MTG193 MTG194 MTG195 MTG196 MTG198 MTG199 MTG200 MTG201 NT1 NT2 NT3 PCA35117 R13 R63 R67 R103 R104 R105 R106 R187 R215 R219 R277 R278 R381 R382 R383 R384 R386 R387 R388 R395 R399 R400 R405 R503 R504 R505 R506 R513 R514 R515 R516 R522 R523 R525 R538 R539 R540 R541 R543 R544 R549 R550 R555 R556 R558 R559 R560 R561 R562 R578 TP1 TP3 TP4 TP5 TP6 TP7 TP8 TP9 TP10 TP11 TP12 TP13 TP14 TP16 TP21 TP22 TP23 TP24 TP25 TP26 TP27 TP28 TP29 TP30 TP31 TP32 TP33 TP34 TP35 TP36 TP37 TP38 TP39 TP40 TP41 TP42 TP43 TP44 TP45 TP46 TP47 TP48 TP49 TP50 TP51 TP52 TP53 TP54 TP55 TP56 TP57 TP58 TP59 TP60 TP61 TP62 U32 U90DC U123DC
35132-001: not fitted 0 2 A1 A1_J1 A1_J18 C434 C578 C581 C605 C616 C789 C821 C959 COAX1 COAX2 COAX3 COAX4 COAX5 COAX6 COAX8 COAX9 COAX10 COAX11 COAX12 COAX13 COAX14 COAX15 COAX16 COAX17 COAX18 COAX19 COAX20 COAX21 FL21 FL69 FL71 FL72 FT1 FT2 FT3 FT4 FT5 FT6 FT7 FT8 FT9 FT10 FT11 FT13 FT14 FT15 FT16 FT17 FT18 FT19 FT20 FT21 FT22 FT23 FT24 FT25 FT26 FT27 FT28 FT29 FT30 FT31 FT32 FT33 FT34 FT35 FUD1 FUD2 FUD3 FUD4 FUD5 FUD6 J19 J23 J24 J25 L8 L9 L10 L11 L17 L18 L54 L55 L78 L79 L84 L85 L153 L154 L155 L157 L188 L190 L231 L232 L233 L234 L240 L241 L242 L243 MH1 MH2 MH3 MH4 MH5 MH6 MH7 MH8 MH9 MH10 MH11 MH12 MH13 MH14 MH15 MH16 MH17 MH18 MH19 MTG1 MTG2 MTG3 MTG4 MTG5 MTG6 MTG7 MTG8 MTG9 MTG10 MTG11 MTG12 MTG13 MTG14 MTG15 MTG16 MTG17 MTG18 MTG19 MTG20 MTG21 MTG22 MTG23 MTG24 MTG25 MTG26 MTG27 MTG28 MTG29 MTG30 MTG31 MTG32 MTG33 MTG34 MTG35 MTG36 MTG37 MTG38 MTG39 MTG40 MTG41 MTG42 MTG43 MTG44 MTG45 MTG46 MTG47 MTG48 MTG49 MTG50 MTG51 MTG52 MTG53 MTG54 MTG55 MTG56 MTG57 MTG58 MTG59 MTG60 MTG61 MTG62 MTG63 MTG64 MTG65 MTG66 MTG67 MTG68 MTG69 MTG70 MTG71 MTG72 MTG73 MTG74 MTG75 MTG76 MTG77 MTG78 MTG79 MTG80 MTG81 MTG82 MTG83 MTG84 MTG85 MTG86 MTG87 MTG88 MTG89 MTG90 MTG91 MTG92 MTG93 MTG94 MTG95 MTG96 MTG97 MTG98 MTG99 MTG100 MTG101 MTG102 MTG103 MTG104 MTG105 MTG106 MTG107 MTG108 MTG109 MTG110 MTG111 MTG112 MTG113 MTG114 MTG115 MTG116 MTG117 MTG118 MTG119 MTG120 MTG121 MTG122 MTG123 MTG124 MTG125 MTG126 MTG127 MTG128 MTG129 MTG130 MTG131 MTG132 MTG133 MTG134 MTG135 MTG136 MTG137 MTG138 MTG139 MTG140 MTG141 MTG142 MTG143 MTG144 MTG145 MTG146 MTG147 MTG148 MTG149 MTG150 MTG151 MTG152 MTG153 MTG154 MTG155 MTG156 MTG157 MTG158 MTG159 MTG160 MTG161 MTG162 MTG163 MTG164 MTG165 MTG166 MTG167 MTG168 MTG169 MTG170 MTG171 MTG172 MTG173 MTG174 MTG175 MTG176 MTG177 MTG178 MTG179 MTG180 MTG181 MTG182 MTG183 MTG184 MTG185 MTG186 MTG187 MTG188 MTG189 MTG190 MTG191 MTG192 MTG193 MTG194 MTG195 MTG196 MTG198 MTG199 MTG200 MTG201 NT1 NT2 NT3 PCA35117 R13 R63 R67 R103 R104 R105 R106 R187 R215 R219 R277 R278 R381 R382 R383 R384 R385 R393 R394 R399 R400 R404 R405 R408 R503 R504 R505 R506 R513 R514 R515 R516 R522 R523 R525 R538 R539 R540 R541 R543 R544 R549 R550 R555 R556 R558 R559 R560 R561 R562 R578 TP1 TP3 TP4 TP5 TP6 TP7 TP8 TP9 TP10 TP11 TP12 TP13 TP14 TP16 TP21 TP22 TP23 TP24 TP25 TP26 TP27 TP28 TP29 TP30 TP31 TP32 TP33 TP34 TP35 TP36 TP37 TP38 TP39 TP40 TP41 TP42 TP43 TP44 TP45 TP46 TP47 TP48 TP49 TP50 TP51 TP52 TP53 TP54 TP55 TP56 TP57 TP58 TP59 TP60 TP61 TP62 U32 U90 U123